# Altium schematic sheet io.SchDoc: RevCode
size OrCAD B; DocumentNumber: Page Create Date; Revision: TitleBlock0; SheetNumber: 1; SheetTotal: 1
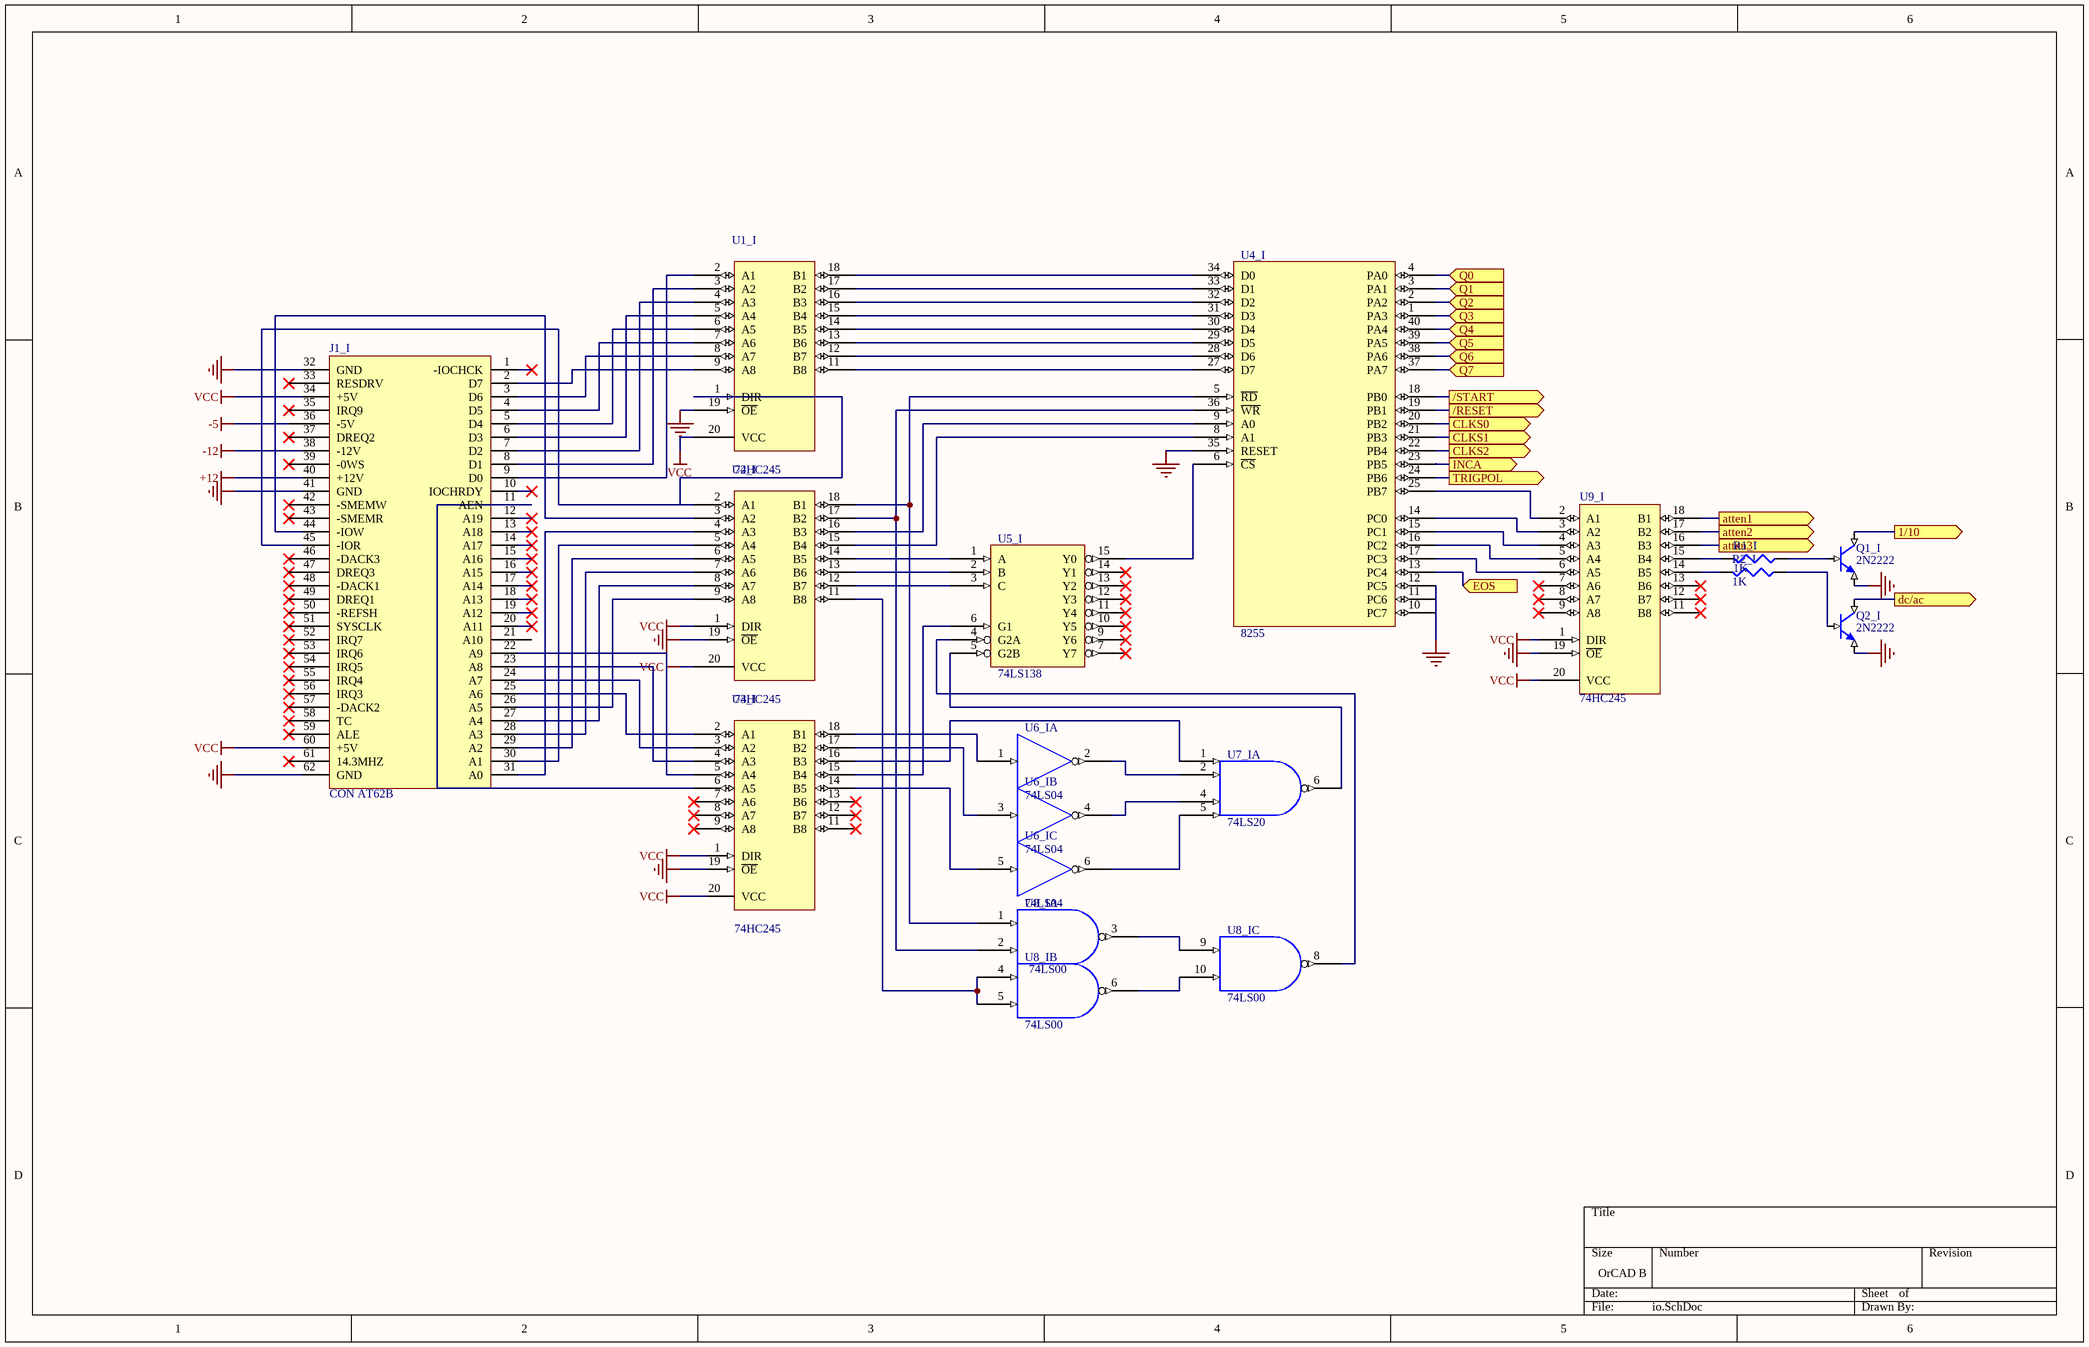
[diagram p0: io.SchDoc]

## Parts
J1_I  CON AT62B  [PCCON2X31]
Q1_I  2N2222  [TO92C]
Q2_I  2N2222  [TO92C]
R1_I  1K  [AXIAL0.3]
R2_I  1K  [AXIAL0.3]
U1_I  74HC245  [DIP-20]
U2_I  74HC245  [DIP-20]
U3_I  74HC245  [DIP-20]
U4_I  8255  [DIP-40]
U5_I  74LS138  [DIP-16]
U6_I  74LS04  [DIP-14]  (parts A,B,C of 6)
U7_I  74LS20  [DIP-14]  (part A of 2)
U8_I  74LS00  [DIP-14]  (parts A,B,C of 4)
U9_I  74HC245  [DIP-20]

## Ports
1/10 (out), /RESET (out), /START (out), atten1 (out), atten2 (out), atten3 (out), CLKS0 (out), CLKS1 (out), CLKS2 (out), dc/ac (out), EOS (in), INCA (out), Q0 (in), Q1 (in), Q2 (in), Q3 (in), Q4 (in), Q5 (in), Q6 (in), Q7 (in), TRIGPOL (out)

## Nets
+12: J1_I.40(+12V)
-5: J1_I.36(-5V)
-12: J1_I.38(-12V)
GND: J1_I.32(GND) J1_I.41(GND) J1_I.62(GND) Q1_I.3(E) Q2_I.3(E) U1_I.10(GND) U1_I.19(~{OE}) U2_I.10(GND) U2_I.19(~{OE}) U3_I.10(GND) U3_I.19(~{OE}) U4_I.7(GND) U4_I.10(PC7) U4_I.11(PC6) U4_I.12(PC5) U4_I.35(RESET) U5_I.8(GND) U6_I.7(GND) U7_I.7(GND) U8_I.7(GND) U9_I.10(GND) U9_I.19(~{OE})
VCC: J1_I.34(+5V) J1_I.60(+5V) U1_I.20(VCC) U2_I.1(DIR) U2_I.20(VCC) U3_I.1(DIR) U3_I.20(VCC) U4_I.26(VCC) U5_I.16(VCC) U6_I.14(VCC) U7_I.14(VCC) U8_I.14(VCC) U9_I.1(DIR) U9_I.20(VCC)
1/10: Q1_I.1(C) ; port 1/10
/RESET: U4_I.19(PB1) ; port /RESET
/START: U4_I.18(PB0) ; port /START
atten1: U9_I.18(B1) ; port atten1
atten2: U9_I.17(B2) ; port atten2
atten3: U9_I.16(B3) ; port atten3
CLKS0: U4_I.20(PB2) ; port CLKS0
CLKS1: U4_I.21(PB3) ; port CLKS1
CLKS2: U4_I.22(PB4) ; port CLKS2
dc/ac: Q2_I.1(C) ; port dc/ac
EOS: U4_I.13(PC4) ; port EOS
INCA: U4_I.23(PB5) ; port INCA
Q0: U4_I.4(PA0) ; port Q0
Q1: U4_I.3(PA1) ; port Q1
Q2: U4_I.2(PA2) ; port Q2
Q3: U4_I.1(PA3) ; port Q3
Q4: U4_I.40(PA4) ; port Q4
Q5: U4_I.39(PA5) ; port Q5
Q6: U4_I.38(PA6) ; port Q6
Q7: U4_I.37(PA7) ; port Q7
TRIGPOL: U4_I.24(PB6) ; port TRIGPOL
NetJ1_I_2: J1_I.2(D7) U1_I.9(A8)
NetJ1_I_3: J1_I.3(D6) U1_I.8(A7)
NetJ1_I_4: J1_I.4(D5) U1_I.7(A6)
NetJ1_I_5: J1_I.5(D4) U1_I.6(A5)
NetJ1_I_6: J1_I.6(D3) U1_I.5(A4)
NetJ1_I_7: J1_I.7(D2) U1_I.4(A3)
NetJ1_I_8: J1_I.8(D1) U1_I.3(A2)
NetJ1_I_9: J1_I.9(D0) U1_I.2(A1)
NetJ1_I_11: J1_I.11(AEN) U3_I.6(A5)
NetJ1_I_22: J1_I.22(A9) U3_I.5(A4)
NetJ1_I_23: J1_I.23(A8) U3_I.4(A3)
NetJ1_I_24: J1_I.24(A7) U3_I.3(A2)
NetJ1_I_25: J1_I.25(A6) U3_I.2(A1)
NetJ1_I_26: J1_I.26(A5) U2_I.9(A8)
NetJ1_I_27: J1_I.27(A4) U2_I.8(A7)
NetJ1_I_28: J1_I.28(A3) U2_I.7(A6)
NetJ1_I_29: J1_I.29(A2) U2_I.6(A5)
NetJ1_I_30: J1_I.30(A1) U2_I.5(A4)
NetJ1_I_31: J1_I.31(A0) U2_I.4(A3)
NetJ1_I_44: J1_I.44(-IOW) U2_I.3(A2)
NetJ1_I_45: J1_I.45(-IOR) U1_I.1(DIR) U2_I.2(A1)
NetQ1_I_2: Q1_I.2(B) R1_I.2(BOT)
NetQ2_I_2: Q2_I.2(B) R2_I.2(BOT)
NetR1_I_1: R1_I.1(TOP) U9_I.15(B4)
NetR2_I_1: R2_I.1(TOP) U9_I.14(B5)
NetU1_I_11: U1_I.11(B8) U4_I.27(D7)
NetU1_I_12: U1_I.12(B7) U4_I.28(D6)
NetU1_I_13: U1_I.13(B6) U4_I.29(D5)
NetU1_I_14: U1_I.14(B5) U4_I.30(D4)
NetU1_I_15: U1_I.15(B4) U4_I.31(D3)
NetU1_I_16: U1_I.16(B3) U4_I.32(D2)
NetU1_I_17: U1_I.17(B2) U4_I.33(D1)
NetU1_I_18: U1_I.18(B1) U4_I.34(D0)
NetU2_I_11: U2_I.11(B8) U8_I.4(I0) U8_I.5(I1)
NetU2_I_12: U2_I.12(B7) U5_I.3(C)
NetU2_I_13: U2_I.13(B6) U5_I.2(B)
NetU2_I_14: U2_I.14(B5) U5_I.1(A)
NetU2_I_15: U2_I.15(B4) U4_I.8(A1)
NetU2_I_16: U2_I.16(B3) U4_I.9(A0)
NetU2_I_17: U2_I.17(B2) U4_I.36(~{WR}) U8_I.2(I1)
NetU2_I_18: U2_I.18(B1) U4_I.5(~{RD}) U8_I.1(I0)
NetU3_I_14: U3_I.14(B5) U6_I.5(I)
NetU3_I_15: U3_I.15(B4) U5_I.6(G1)
NetU3_I_16: U3_I.16(B3) U7_I.1(I0)
NetU3_I_17: U3_I.17(B2) U6_I.3(I)
NetU3_I_18: U3_I.18(B1) U6_I.1(I)
NetU4_I_6: U4_I.6(~{CS}) U5_I.15(Y0)
NetU4_I_14: U4_I.14(PC0) U9_I.3(A2)
NetU4_I_15: U4_I.15(PC1) U9_I.4(A3)
NetU4_I_16: U4_I.16(PC2) U9_I.5(A4)
NetU4_I_17: U4_I.17(PC3) U9_I.6(A5)
NetU4_I_25: U4_I.25(PB7) U9_I.2(A1)
NetU5_I_4: U5_I.4(G2A) U8_I.8(O)
NetU5_I_5: U5_I.5(G2B) U7_I.6(O)
NetU6_I_2: U6_I.2(O) U7_I.2(I1)
NetU6_I_4: U6_I.4(O) U7_I.4(I2)
NetU6_I_6: U6_I.6(O) U7_I.5(I3)
NetU8_I_3: U8_I.3(O) U8_I.9(I0)
NetU8_I_6: U8_I.6(O) U8_I.10(I1)

Not connected (* = marked no-connect by the designer): J1_I 1(-IOCHCK)* 10(IOCHRDY)* 12(A19)* 13(A18)* 14(A17)* 15(A16)* 16(A15)* 17(A14)* 18(A13)* 19(A12)* 20(A11)* 21(A10) 33(RESDRV)* 35(IRQ9)* 37(DREQ2)* 39(-0WS)* 42(-SMEMW)* 43(-SMEMR)* 46(-DACK3)* 47(DREQ3)* 48(-DACK1)* 49(DREQ1)* 50(-REFSH)* 51(SYSCLK)* 52(IRQ7)* 53(IRQ6)* 54(IRQ5)* 55(IRQ4)* 56(IRQ3)* 57(-DACK2)* 58(TC)* 59(ALE)* 61(14.3MHZ)*; U3_I 7(A6)* 8(A7)* 9(A8)* 11(B8)* 12(B7)* 13(B6)*; U5_I 7(Y7)* 9(Y6)* 10(Y5)* 11(Y4)* 12(Y3)* 13(Y2)* 14(Y1)*; U9_I 7(A6)* 8(A7)* 9(A8)* 11(B8)* 12(B7)* 13(B6)*

## Library data of the parts
J1_I = CON AT62B: Text Field1: 120; Text Field2: 320
Q1_I Q2_I = 2N2222: NPN BJT
R1_I R2_I = RES: Resistor; Value: 1K
U1_I U2_I U3_I U9_I = 74HC245: Text Field1: 60; Text Field2: 140
U4_I = 8255: Text Field1: 120; Text Field2: 270
U5_I = 74LS138: Text Field1: 70; Text Field2: 90
U6_I = 74LS04: Text Field1: 40; Text Field2: 40
U7_I = 74LS20: Text Field1: 60; Text Field2: 40
U8_I = 74LS00: Text Field1: 60; Text Field2: 40